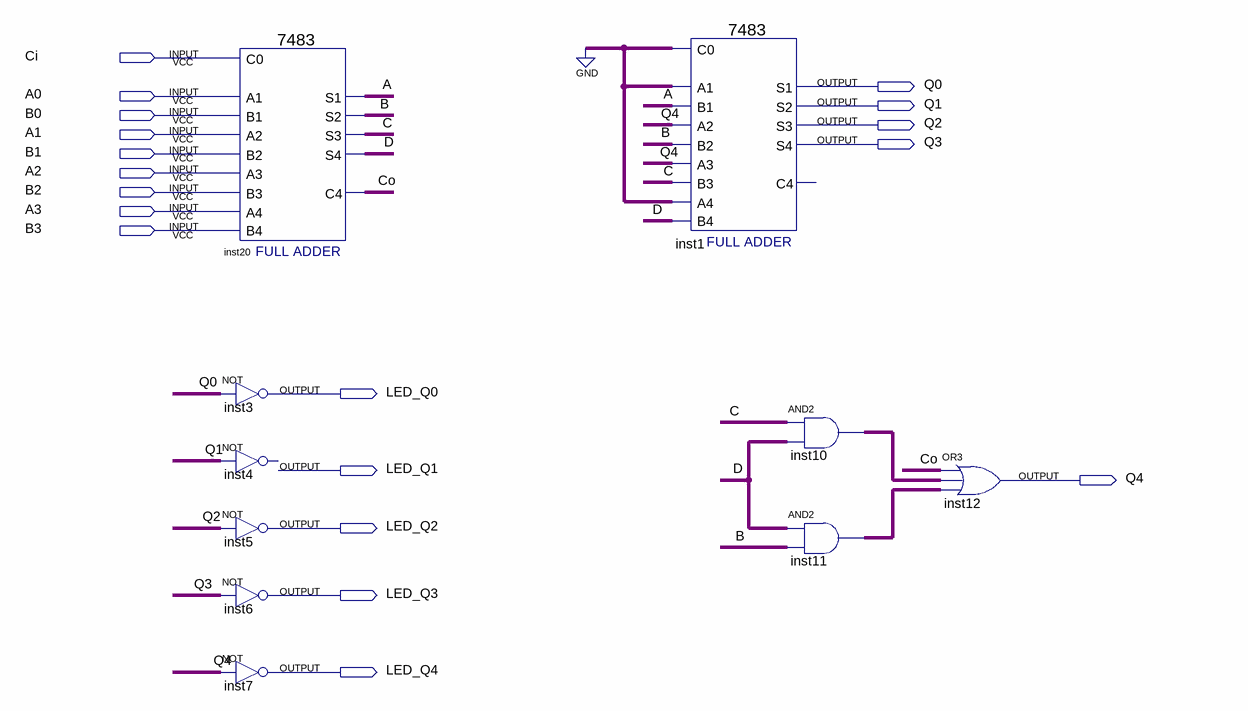
[diagram p0: schematic sheet]
// Quartus schematic BCD7483.bdf as structural Verilog: 10 symbols, 19 pins
module BCD7483 (
  input  Ci,
  input  A0,
  input  B0,
  input  A1,
  input  B1,
  input  A2,
  input  B2,
  input  A3,
  input  B3,
  output Q0,
  output Q1,
  output Q2,
  output Q3,
  output LED_Q0,
  output LED_Q1,
  output Q4,
  output LED_Q2,
  output LED_Q3,
  output LED_Q4
);

  wire A, B, C, Co, D, inst10_out, inst11_out;

  \7483  inst20 (
    .B4(B3), .C0(Ci), .A1(A0), .A2(A1), .B1(B0), .B2(B1), .A3(A2), .B3(B2), .A4(A3), .S3(C), .S4(D), .S2(B),
    .C4(Co), .S1(A));
  not inst3 (LED_Q0, Q0);
  // NOT inst4 has open pins: IN=Q1, OUT=open
  not inst5 (LED_Q2, Q2);
  not inst6 (LED_Q3, Q3);
  not inst7 (LED_Q4, Q4);
  \7483  inst1 (
    .B4(D), .C0(1'b0), .A1(1'b0), .A2(Q4), .B1(A), .B2(B), .A3(Q4), .B3(C), .A4(1'b0), .S3(Q2), .S4(Q3),
    .S2(Q1), .S1(Q0));  // open: C4
  and inst10 (inst10_out, C, D);
  and inst11 (inst11_out, D, B);
  or inst12 (Q4, Co, inst10_out, inst11_out);
endmodule
